# Altium project MSE312_SIMRACER.PrjPcb
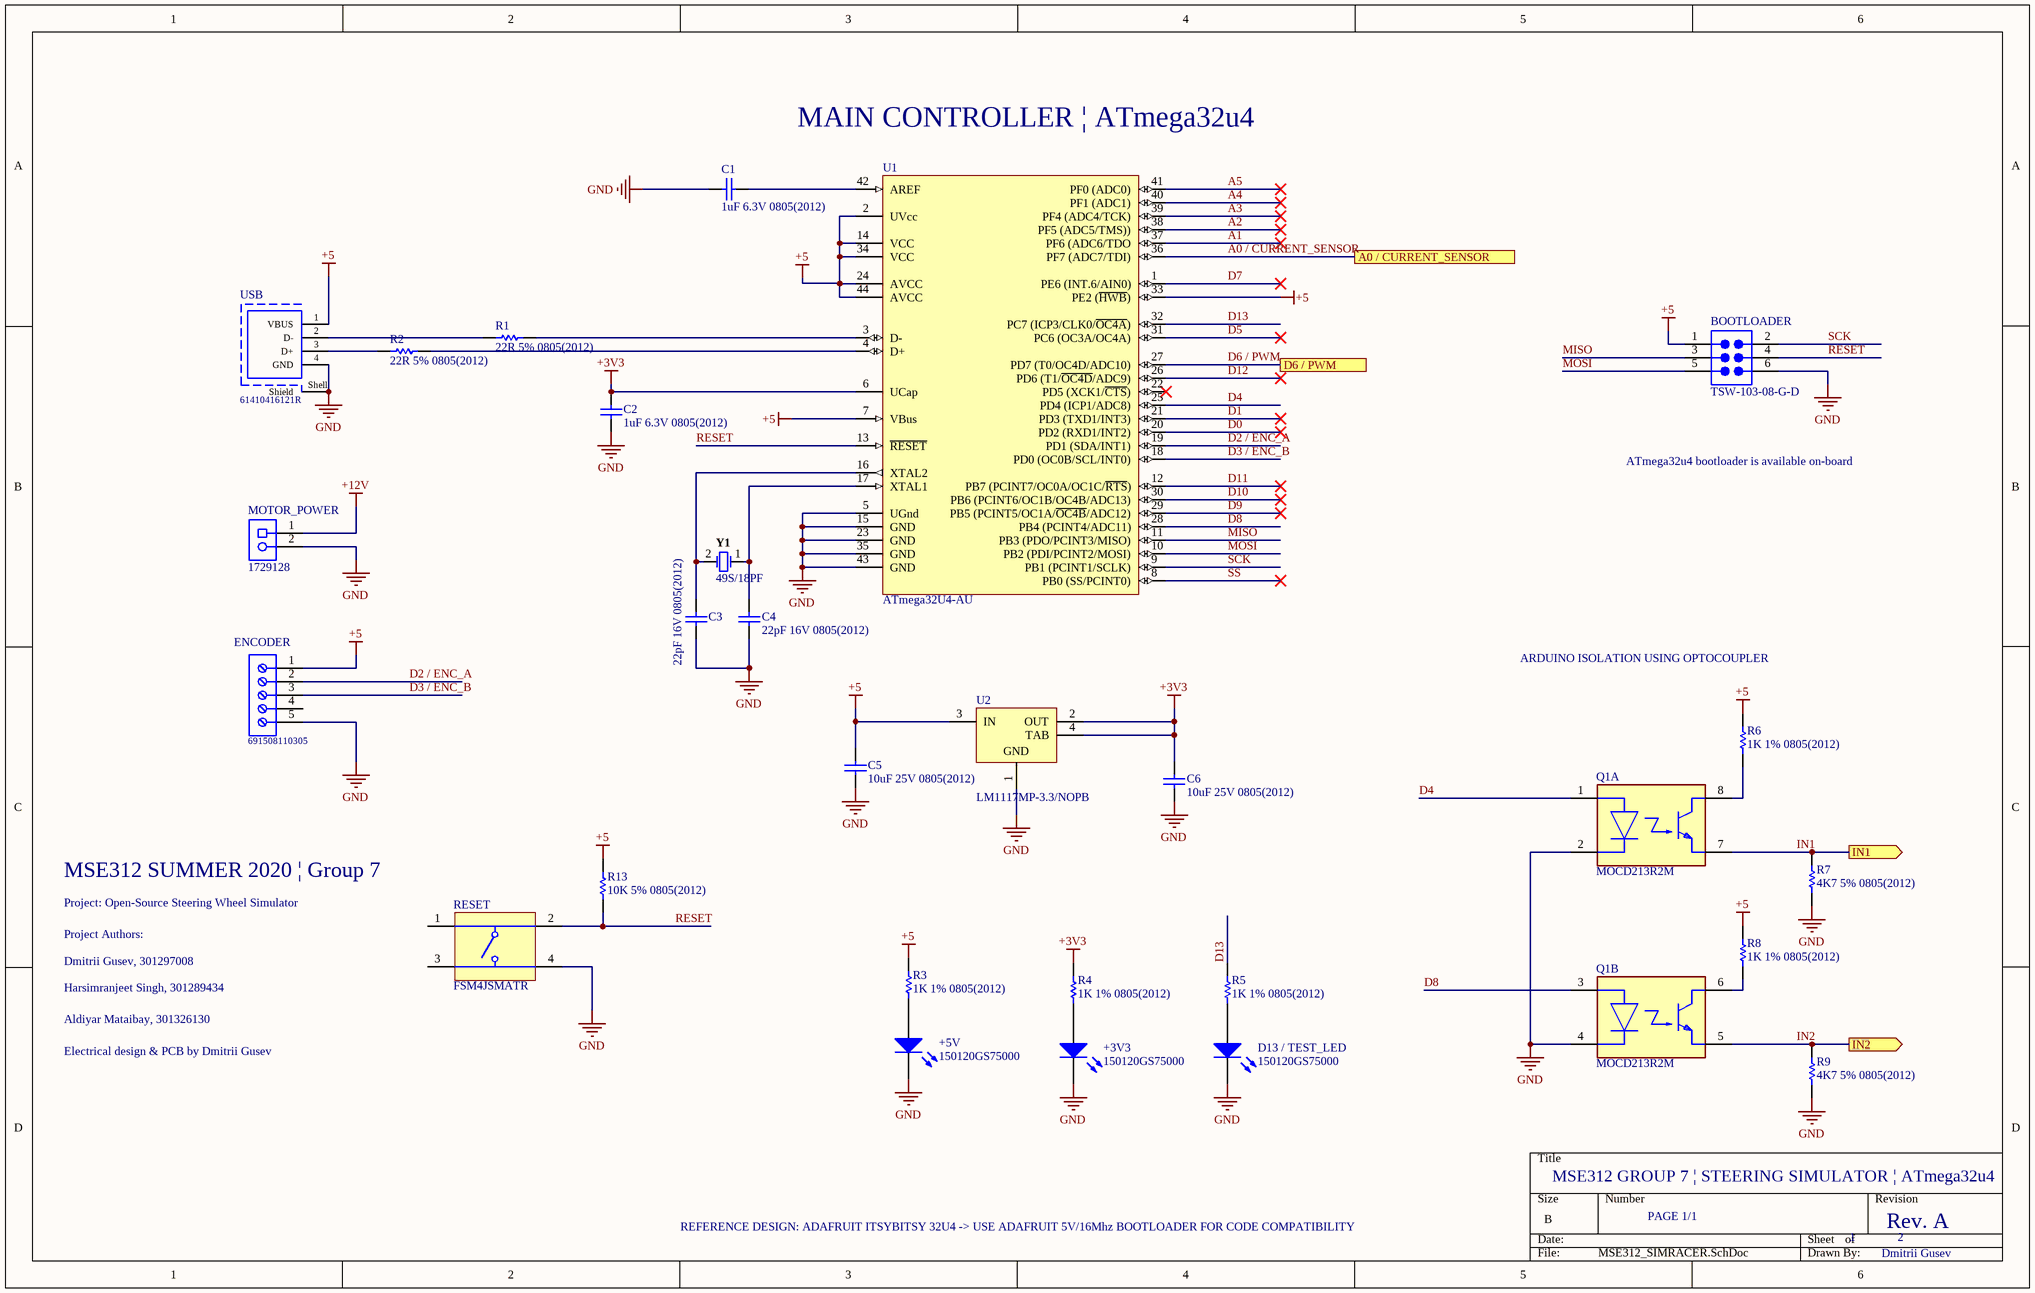
[diagram p0: MSE312_SIMRACER.SchDoc]
2 sheets, 42 parts. Net scope: flat (ports and power ports of the same name join across sheets).
Board file: MSE312_SIMRACER.PcbDoc
Sheets:
  MSE312_SIMRACER.SchDoc
  L298N.SchDoc

## Sheet MSE312_SIMRACER.SchDoc
size B

### Parts
+3V3  150120GS75000  [1206_A]
+5V  150120GS75000  [1206_A]
BOOTLOADER  TSW-103-08-G-D  [SMTC-TSW-103-08-X-D]
C1  1uF 6.3V 0805(2012)  [CAPC0805(2012)145_N]
C2  1uF 6.3V 0805(2012)  [CAPC0805(2012)145_N]
C3  22pF 16V 0805(2012)  [CAPC0805(2012)100_N]
C4  22pF 16V 0805(2012)  [CAPC0805(2012)100_N]
C5  10uF 25V 0805(2012)  [CAPC0805(2012)145_N]
C6  10uF 25V 0805(2012)  [CAPC0805(2012)145_N]
D13_/_TEST_LED  150120GS75000  [1206_A]
ENCODER  691508110305  [691508110305]
MOTOR_POWER  1729128  [PHOE-1729128-2_V]
Q1  MOCD213R2M  [FP-751DZ-MFG]  (parts A,B of 2)
R1  22R 5% 0805(2012)  [RESC0805(2012)_M]
R2  22R 5% 0805(2012)  [RESC0805(2012)_M]
R3  1K 1% 0805(2012)  [RESC0805(2012)_M]
R4  1K 1% 0805(2012)  [RESC0805(2012)_M]
R5  1K 1% 0805(2012)  [RESC0805(2012)_M]
R6  1K 1% 0805(2012)  [RESC0805(2012)_M]
R7  4K7 5% 0805(2012)  [RESC0805(2012)_N]
R8  1K 1% 0805(2012)  [RESC0805(2012)_M]
R9  4K7 5% 0805(2012)  [RESC0805(2012)_N]
R13  10K 5% 0805(2012)  [RESC0805(2012)_L]
RESET  FSM4JSMATR  [TECO-FSM4JSMATR_V]
U1  ATmega32U4-AU  [44ML_M]
U2  LM1117MP-3.3/NOPB  [DCY0004A_L]
USB  61410416121R  [61410416121R]
Y1  49S/18PF  [JPY-49S-18PF]

### Ports
A0 / CURRENT_SENSOR, D6 / PWM, IN1 (out), IN2 (out)

### Nets
+3V3: C2.2 C6.2 R4.2 U1.6(UCap) U2.2(OUT) U2.4(TAB)
+5: BOOTLOADER.1 C5.2 ENCODER.1 R3.2 R6.2 R8.2 R13.2 U1.2(UVcc) U1.7(VBus) U1.14(VCC) U1.24(AVCC) U1.33(PE2_(~{HWB})) U1.34(VCC) U1.44(AVCC) U2.3(IN) USB.1(VBUS)
+12V: MOTOR_POWER.1
GND: +3V3.1(K) +5V.1(K) BOOTLOADER.6 C1.1 C2.1 C3.1 C4.1 C5.1 C6.1 D13_/_TEST_LED.1(K) ENCODER.5 MOTOR_POWER.2 Q1.2(CATHODE1) Q1.4(CATHODE2) R7.1 R9.1 RESET.4 U1.5(UGnd) U1.15(GND) U1.23(GND) U1.35(GND) U1.43(GND) U2.1(GND) USB.4(GND) USB.Shell(Shield)
A0 / CURRENT_SENSOR: U1.36(PF7_(ADC7/TDI)) ; port A0 / CURRENT_SENSOR
A1: U1.37(PF6_(ADC6/TDO)
A2: U1.38(PF5_(ADC5/TMS)))
A3: U1.39(PF4_(ADC4/TCK))
A4: U1.40(PF1_(ADC1))
A5: U1.41(PF0_(ADC0))
D0: U1.20(PD2_(RXD1/INT2))
D1: U1.21(PD3_(TXD1/INT3))
D2 / ENC_A: ENCODER.2 U1.19(PD1_(SDA/INT1))
D3 / ENC_B: ENCODER.3 U1.18(PD0_(OC0B/SCL/INT0))
D4: Q1.1(ANODE1) U1.25(PD4_(ICP1/ADC8))
D5: U1.31(PC6_(OC3A/OC4A))
D6 / PWM: U1.27(PD7_(T0/OC4D/ADC10)) ; port D6 / PWM
D7: U1.1(PE6_(INT.6/AIN0))
D8: Q1.3(ANODE2) U1.28(PB4_(PCINT4/ADC11))
D9: U1.29(PB5_(PCINT5/OC1A/~{OC4B}/ADC12))
D10: U1.30(PB6_(PCINT6/OC1B/OC4B/ADC13))
D11: U1.12(PB7_(PCINT7/OC0A/OC1C/~{RTS}))
D12: U1.26(PD6_(T1/~{OC4D}/ADC9))
D13: R5.2 U1.32(PC7_(ICP3/CLK0/~{OC4A}))
IN1: Q1.7(EMITTER1) R7.2 ; port IN1
IN2: Q1.5(EMITTER2) R9.2 ; port IN2
MISO: BOOTLOADER.3 U1.11(PB3_(PDO/PCINT3/MISO))
MOSI: BOOTLOADER.5 U1.10(PB2_(PDI/PCINT2/MOSI))
RESET: BOOTLOADER.4 R13.1 RESET.2 U1.13(~{RESET})
SCK: BOOTLOADER.2 U1.9(PB1_(PCINT1/SCLK))
SS: U1.8(PB0_(SS/PCINT0))
Net+3V3_2: +3V3.2(A) R4.1
Net+5V_2: +5V.2(A) R3.1
NetC1_2: C1.2 U1.42(AREF)
NetC3_2: C3.2 U1.16(XTAL2) Y1.2
NetC4_2: C4.2 U1.17(XTAL1) Y1.1
NetD13_/_TEST_LED_2: D13_/_TEST_LED.2(A) R5.1
NetQ1_6: Q1.6(COLLECTOR2) R8.1
NetQ1_8: Q1.8(COLLECTOR1) R6.1
NetR1_1: R1.1 USB.2(D-)
NetR1_2: R1.2 U1.3(D-)
NetR2_1: R2.1 USB.3(D+)
NetR2_2: R2.2 U1.4(D+)

Not connected (* = marked no-connect by the designer): ENCODER 4; RESET 1 3; U1 22(PD5_(XCK1/~{CTS}))*

### Notes on the sheet
- MAIN CONTROLLER | ATmega32u4
- ATmega32u4 bootloader is available on-board
- ARDUINO ISOLATION USING OPTOCOUPLER
- MSE312 SUMMER 2020 | Group 7
- Project: Open-Source Steering Wheel Simulator
- Project Authors:
- Dmitrii Gusev, 301297008
- Harsimranjeet Singh, 301289434
- Aldiyar Mataibay, 301326130
- Electrical design & PCB by Dmitrii Gusev
- REFERENCE DESIGN: ADAFRUIT ITSYBITSY 32U4 -> USE ADAFRUIT 5V/16Mhz BOOTLOADER FOR CODE COMPATIBILITY
- MSE312 GROUP 7 | STEERING SIMULATOR | ATmega32u4
- PAGE 1/1
- 1
- Rev. A
- 2
- Dmitrii Gusev

### Library data of the parts
+3V3 +5V D13_/_TEST_LED = CMP-1426-00014-1: SMD mono-color Chip LED, WL-SMCW, Green; Manufacturer: Wuerth Elektronik; PackageReference: 1206_A; PartNumber: 150120GS75000; ComponentLink1Description: Manufacturer URL; ComponentLink2URL: http://katalog.we-online.com/led/datasheet/150120GS75000.pdf; ComponentLink2Description: Datasheet; Color: Green; ComponentLink1URL: http://www.we-online.com
BOOTLOADER = CMP-1024-00338-1: Manufacturer: Samtec; Pitch: 2.54 mm; ComponentLink1URL: http://www.samtec.com; ComponentLink2URL: http://www.samtec.com/documents/webfiles/pdf/TSW_TH.PDF; Temperature Range: -55 to 125 degC; RoHS: True; ComponentLink2Description: Datasheet; PackageReference: TSW-103-08-X-D; ComponentLink3Description: Package Specification; PackageDescription: .025[0.64] SQ. Post Terminal Strip Assembly; DatasheetVersion: F-214; Mounting Technology: Through-hole; ComponentLink1Description: Manufacturer URL; Orientation: Vertical; PartNumber: TSW-103-08-G-D; PackageVersion: DM, 8/1988; ComponentLink3URL: http://www.samtec.com/documents/webfiles/cpdf/TSW-XXX-XX-XXX-X-XX-XXX-MKT.pdf
C1 C2 = CMP-1036-04731-1: CAP 1uF 6.3V ±10% 0805 (2012 Metric) Thickness 1.45mm SMD; Case-Metric: 2012; Case-EIA: 0805; Tolerance: Â±10%; Max Thickness: 1.45 mm; Technology: SMT; Value: 1uF; Rated Voltage: 6.3 V
C3 C4 = CMP-1036-01215-1: CAP 22pF 16V ±0.5pF 0805 (2012 Metric) Thickness 1mm SMD; Tolerance: Â±0.5pF; Case-EIA: 0805; Case-Metric: 2012; Max Thickness: 1 mm; Technology: SMT; Rated Voltage: 16 V; Value: 22pF
C5 C6 = CMP-1036-04932-1: CAP 10uF 25V ±10% 0805 (2012 Metric) Thickness 1.45mm SMD; Case-EIA: 0805; Case-Metric: 2012; Tolerance: Â±10%; Technology: SMT; Value: 10uF; Rated Voltage: 25 V; Max Thickness: 1.45 mm
ENCODER = CMP-1502-02493-1: Serie 5081 - 3.50 mm Horizontal Entry SMT with Rising Cage Clamp WR-TBL, 5 pin; Manufacturer: Wurth Elektronik; Pin Number: 5; Pitch: 3.50mm; Operating Temperature: -40to130degC; Packaging: TapeandReelwithCap; Part Number: 691508110305; Publisher: WurthElektronik; Datasheet URL: http://katalog.we-online.de/em/datasheet/6915081103xx.pdf; Mounting Technology: SMT; Package Reference: 691508110305; Manufacturer URL: http://www.we-online.de
MOTOR_POWER = CMP-2000-05815-1: PCB Terminal Block, 13.5 A, 400 V, 2-Pin THD, RoHS, Bulk; Manufacturer: Phoenix Contact; Package Version: 03/2015; No. of Rows: 1; Pitch: 5.08mm; No. of Positions: 2; Voltage Rating: 400V; Current Rating: 13500mA; Manufacturer URL: http://www.phoenixcontact.com/; Datasheet URL: https://datasheet.ciiva.com/16046/1729128-16046181.pdf; RoHS: TRUE; Package URL: https://www.phoenixcontact.com/online/portal/pi/pxc/product_detail_page/!ut/p/b1/3VdJjqNKFDxLH8AFycySyWY2ozFsEPOMMQaDOX1XedGL_1Vdm5YXJleknhSKeBkvI6EA8ncAo3AYoDhBQGco6KN7VURTdemj9us_IEKEZo_YHiPAEWEFmDGOHMORkqKYCORBZxgL7ZoaZYcbFFUZ3fqxSY6GOuxydWUuHqz1ynmMFygu583Bob0Ewr6Sd_l-5m-kAueHiB0jpRwZwe58wwtkpxtMYd_LmGcDRU02dRNEyWt6Y2ti5pSyJ_reIkzIulrqApdnbT11V5jnCKbYNCvhEM1MCpPByat_X379-iThf08CI5GfOPqfBeS3BRoBOdD55AKVv0iLwCMq-2BrzXWSGRH7pUGD9uwXQjiph3xL0DKQwdGa0JImiIOmBNOestqgwTHSSs2oOep-78apyXQBvNi8ZLaFjvjWvcaUEBu0MC6Wbe-d6mB0FAebo2lUWinqYaZs5DAYzV0RP9yitUjnGJ0iI9xhZkT42OCQNUJJhkgWINNQLP2JFP6OpMg3JCVg70jqHT0lvKOnhHf0lPuOnnLf0VPuWx6_dxwUIvwk5WMkT0kLL1mh61l2yZVSzG3pYV_bqo-mj6uMKwKwdnnW8Jh5RTOJzMOA5c-eJDaZQw4mTMPH02PvS_ZAqNVjVTo2WyYLkwH_KU1mmmG5kjRhDqPXLwwVHvVOjCM60-fpXvTDfMGW1PVFVS1r4e4yVDk4ZdNbkUHvqPqQSeian4UD39fNKmachqdJ1NJbyk8rXT9mXTvPk3oE5meulKGgiruPJek-4I9hTT6G8ZLOyRSm2RRVbThERQad5OS28hdt4YW4vG0stgYYzsWsK4_7y6DZMjJSCqri1kyiZR5vD7pwIrNR7QwPHTcLTI5qT7eRlpHrdGiupYlqQDJ7zy_CND8fWWBoLRXxk1RVcXiBQwbTD4Xi7KL-FuO94t9xaqweXzH; PartNumber: 1729128; Package Description: 2-Pin Through Hole Device, Body 8.1 x 10.16 mm, Pitch 5.08 mm; Datasheet Version: 12/2013; Mounting Technology: ThroughHole; Orientation: Horizontal; Package Reference: 1729128-2; Packing: Bulk
Q1 = CMP-07144-000004-1: OPTOISO 2.5KV 2CH TRANS 8SOIC; Manufacturer: ON Semiconductor; Forward Current: 10mA; Reverse Voltage: 6V; Emiiter Collector Voltage: 7V; Isolation Voltage: 2500Vrms; Max Junction Temp: +125°C; Turn On Delay Time: 7.5us; Standoff Height: 0.08mm; Forward Voltage: 1.15V; Min Current Transfer Ratio: 100%; Collector Emitter Voltage: 70V; Power Dissipation: 240mW; Turn Off Delay Time: 5.7us; Footprint Url: https://www.onsemi.com/pub/Collateral/751DZ.PDF; Lead Free: Yes; Ambient Temperature Range High: +100°C; ComponentLink2URL: https://www.onsemi.com/pub/Collateral/MOCD217M-D.PDF; Digikey Description: OPTOISO 2.5KV 2CH TRANS 8SOIC; Ambient Temperature Range Low: -40°C; Device Class L3: unset; Device Class L2: Optocouplers; Height: 3.63mm; Device Class L1: Optoelectronics; Package: 751DZ; Temperature Range Low: -40°C; Temperature: -40°C to +100°C; Manufacturer Part Number: MOCD213R2M; Temperature Range High: +100°C; Category: Trans; Automotive: No; ComponentLink2Description: Datasheet; Mouser Description: Optocoupler DC-IN 2-Channel Transistor DC-Output 8-Pin SOIC N T/R; Octopart: https://octopart.com/mocd213r2m-on+semiconductor-84330505; RoHS: TRUE; PartId: 1
R1 R2 = CMP-1013-00034-1: 22R 0.125W 5% 0805 (2012 Metric)  SMD; Case-Metric: 2012; Value: 22.00 Ohm; Case-EIA: 0805; Power: 0.125 W; Technology: SMT; Tolerance: 5 %
R3-R6 R8 = CMP-1013-00510-1: 1K 0.125W 1% 0805 (2012 Metric)  SMD; Case-Metric: 2012; Value: 1000.00 Ohm; Case-EIA: 0805; Tolerance: 1 %; Power: 0.125 W; Technology: SMT
R7 R9 = CMP-1013-00090-1: 4K7 0.125W 5% 0805 (2012 Metric)  SMD; Case-EIA: 0805; Value: 4700.00 Ohm; Case-Metric: 2012; Power: 0.125 W; Tolerance: 5 %; Technology: SMT
R13 = CMP-1013-00098-1: 10K 0.125W 5% 0805 (2012 Metric)  SMD; Case-EIA: 0805; Case-Metric: 2012; Value: 10000.00 Ohm; Power: 0.125 W; Technology: SMT; Tolerance: 5 %
RESET = CMP-2000-07486-1: Micro Miniature Push Button Switch FSM JSM, 50 mA, -35 to 85 degC, 4-Pin SMD, RoHS, Tape and Reel; Manufacturer: TE Connectivity; Mechanical Life: 100000Cycles; Current Rating: 50mA; Actuator Material: Polyamide; Max Voltage Rating (DC): 12V; Capacitance: 0f; Illumination Type: Illuminated; Voltage Rating (DC): 24V; Case\/Package: SMD/SMT; Operating Force: 160gf; Contact Resistance: 100mOhm; Actuator Length: 0.055inch; Switch Travel: 0.25mm; Throw Configuration: SPST; Termination: GullWing; Contact Plating: Silver; Orientation: Straight; Mounting Technology: SurfaceMount; REACH SVHC: Unknown; Electrical Life: 100000Cycles; Package Reference: FSM4JSMATR; Max Operating Temperature: 85degC; Manufacturer URL: http://www.te.com/; Package Description: 4-Pin Surface Mount Device, Body 6 x 6 mm, Pitch 4.5 mm; Datasheet Version: Rev. V, 02/2015; Packaging: TapeandReel; Min Operating Temperature: -35degC; Mount: SurfaceMount; Contact Current Rating: 50mA; Contact Material: CopperAlloy; Package Quantity: 1200; Datasheet URL: http://www.te.com/commerce/DocumentDelivery/DDEController?Action=showdoc&DocId=Customer+Drawing%7F2-1437565-7%7FV%7Fpdf%7FEnglish%7FENG_CD_2-1437565-7_V.pdf%7F4-1437565-2; RoHSCompliant: true
U1 = CMP-0095-00285-2: 8-bit AVR Microcontroller, 2.7-5.5V, 16MHz, 32KB Flash, 1KB EEPROM, 2.5KB SRAM, USB Controller, 44-pin TQFP, Industrial Grade (-40°C to 85°C), Ext Osc; RevisionNote: DatasheetVersion updated. URLs added.; ComponentLink1Description: Manufacturer URL; PackageDescription: 44-Pin Plastic Thin Quad Flat Pack, 10 x 10 x 1.0 mm Body, 0.8 mm Pitch (TQFP); DatasheetVersion: revF, Nov-2010; ComponentLink2URL: http://www.atmel.com/dyn/resources/prod_documents/doc7766.pdf; ComponentLink1URL: http://www.atmel.com/; PackageReference: 44ML; ComponentLink2Description: ATmega16U4/32U4 Datasheet; PackageVersion: rev.G, Jul-2007; ComponentLink3URL: http://www.atmel.com/dyn/resources/prod_documents/7766S.pdf; ComponentLink3Description: ATmega16U4 ATmega32U4 Summary
U2 = CMP-0062-01638-4: 800mA Low-Dropout Linear Regulator, 4-pin SOT-223, Pb-Free; Manufacturer: Texas Instruments; CompType: LDO IC; PackageTopMarking: XYTT*N05A; High-Reliability: Y; PowerWise: N; ComponentLink1URL: http://www.ti.com/general/docs/lit/getliterature.tsp?genericPartNumber=LM1117-N&fileType=pdf; PinCount: 4; PackageDescription: Molded SOT-223, 6.50 x 3.56 x 1.6mm Body, 4 Lead, 2.3mm Pitch; Code_IPC: SOT223-4; PartNumber: LM1117MP-3.3/NOPB; Code_JEDEC: TO-261-AA; RoHS: Y; PackageReference: DCY0004A; ComponentLink1Description: Datasheet URL
USB = CMP-1502-03245-1: USB 2.0 Type B Receptacle WR-COM, Horizontal, SMT; Manufacturer: Wurth Elektronik; Rated Current: 1.5A; Working Voltage: 30VAC; Contact Resistance: 30mOhm; Datasheet URL: https://katalog.we-online.de/em/datasheet/61410416121R.pdf; Part Number: 61410416121R; Operating Temperature: -55to85degC; Gender: Receptacle; Orientation: Horizontal; Manufacturer URL: http://www.we-online.de; Mounting Technology: SMT; Publisher: WurthElektronik; Connector Type: USB2.0TypeB; Package Reference: 61410416121R; Packaging: TapeandReel
Y1 = CMP-2100-03581-1: Crystal, 16 MHz, 18 pF, -20 to 70 degC, 2-Pin THD; Manufacturer: Shenzhen Jingpengyuan; Package Description: 2-Pin Through Hole Device, Body 11.05 x 4.65 mm, Pitch 4.88 mm; Package Reference: 49S-18PF; Datasheet Version: 41852.0; Datasheet URL: http://datasheet.octopart.com/49S-18PF-Xinhunjing-datasheet-30677139.pdf; Manufacturer URL: http://www.chjiahui.com/

## Sheet L298N.SchDoc
size B
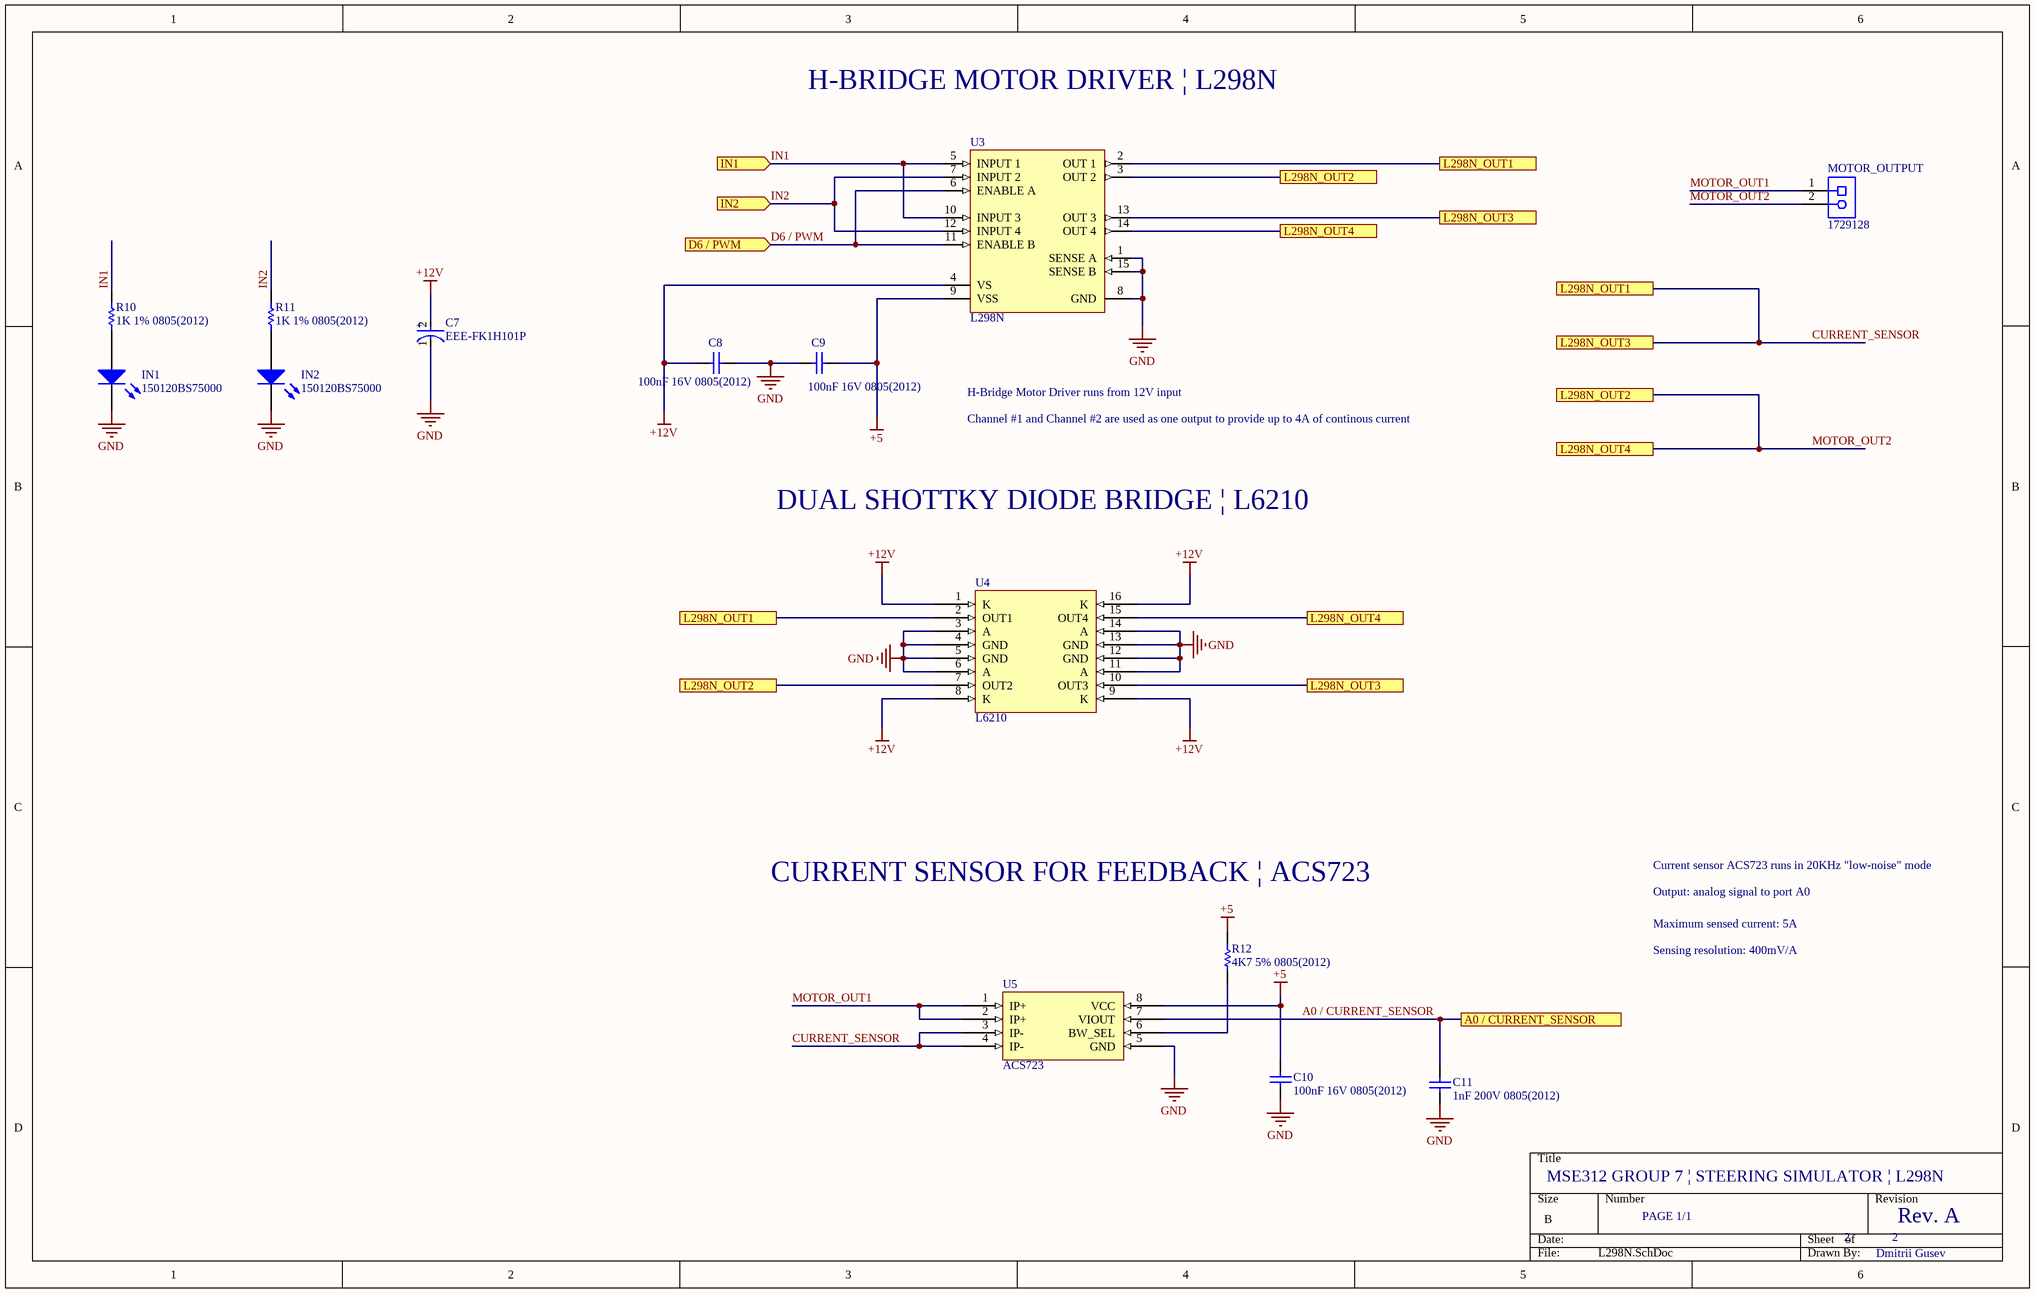
[diagram p1: L298N.SchDoc]

### Parts
C7  EEE-FK1H101P  [FP-EEE-FK1H101P-MFG]
C8  100nF 16V 0805(2012)  [CAPC0805(2012)100_L]
C9  100nF 16V 0805(2012)  [CAPC0805(2012)100_L]
C10  100nF 16V 0805(2012)  [CAPC0805(2012)100_L]
C11  1nF 200V 0805(2012)  [CAPC0805(2012)145_L]
IN1  150120BS75000  [1206_A]
IN2  150120BS75000  [1206_A]
MOTOR_OUTPUT  1729128  [PHOE-1729128-2_V]
R10  1K 1% 0805(2012)  [RESC0805(2012)_M]
R11  1K 1% 0805(2012)  [RESC0805(2012)_M]
R12  4K7 5% 0805(2012)  [RESC0805(2012)_N]
U3  L298N  [STM-FM-15]
U4  L6210  [L6210]
U5  ACS723  [ACS723]

### Ports
A0 / CURRENT_SENSOR, D6 / PWM (in), IN1 (in), IN2 (in), L298N_OUT1, L298N_OUT2, L298N_OUT3, L298N_OUT4

### Nets
+5: C9.2 C10.2 R12.2 U3.9(VSS) U5.8(VCC)
+12V: C7.2(A) C8.1 U3.4(VS) U4.1(K) U4.8(K) U4.9(K) U4.16(K)
GND: C7.1(C) C8.2 C9.1 C10.1 C11.1 IN1.1(K) IN2.1(K) U3.1(SENSE_A) U3.8(GND) U3.15(SENSE_B) U4.3(A) U4.4(GND) U4.5(GND) U4.6(A) U4.11(A) U4.12(GND) U4.13(GND) U4.14(A) U5.5(GND)
A0 / CURRENT_SENSOR: C11.2 U5.7(VIOUT) ; port A0 / CURRENT_SENSOR
CURRENT_SENSOR: U3.2(OUT_1) U3.13(OUT_3) U4.2(OUT1) U4.10(OUT3) U5.3(IP-) U5.4(IP-) ; port L298N_OUT1, port L298N_OUT3
D6 / PWM: U3.6(ENABLE_A) U3.11(ENABLE_B) ; port D6 / PWM
IN1: R10.2 U3.5(INPUT_1) U3.10(INPUT_3) ; port IN1
IN2: R11.2 U3.7(INPUT_2) U3.12(INPUT_4) ; port IN2
MOTOR_OUT1: MOTOR_OUTPUT.1 U5.1(IP+) U5.2(IP+)
MOTOR_OUT2: MOTOR_OUTPUT.2 U3.3(OUT_2) U3.14(OUT_4) U4.7(OUT2) U4.15(OUT4) ; port L298N_OUT2, port L298N_OUT4
NetIN1_2: IN1.2(A) R10.1
NetIN2_2: IN2.2(A) R11.1
NetR12_1: R12.1 U5.6(BW_SEL)

### Notes on the sheet
- H-BRIDGE MOTOR DRIVER | L298N
- H-Bridge Motor Driver runs from 12V input
- Channel #1 and Channel #2 are used as one output to provide up to 4A of continous current
- DUAL SHOTTKY DIODE BRIDGE | L6210
- CURRENT SENSOR FOR FEEDBACK | ACS723
- Current sensor ACS723 runs in 20KHz "low-noise" mode
- Output: analog signal to port A0
- Maximum sensed current: 5A
- Sensing resolution: 400mV/A
- MSE312 GROUP 7 | STEERING SIMULATOR | L298N
- PAGE 1/1
- 2
- Rev. A
- Dmitrii Gusev
- (in symbol CMP-05427-000005-1) +

### Library data of the parts
C7 = CMP-05427-000005-1: CAP ALUM 100UF 20% 50V SMD; Manufacturer: Panasonic Electronic Components; Automotive Grade: Grade 2; Dissipation Factor: 10%; Life: 2000Hours; Ripple Current: 350mA; Material: Aluminum; Esr: 0.34Ω; Leakage Current: 50uA; Tolerance: 20%; Package: 0; ComponentLink2URL: https://industrial.panasonic.com/cdbs/www-data/pdf/RDE0000/ABA0000C1181.pdf; Manufacturer Part Number: EEE-FK1H101P; Temperature Range Low: -55°C; Voltage Rating: 50V; ComponentLink2Description: Datasheet; Category: Cap; Digikey Description: CAP ALUM 100UF 20% 50V SMD; Octopart: https://octopart.com/eeefk1h101p-panasonic-4642841; Automotive: Yes; Temperature: -55°C to +105°C; Capacitance: 100uF; Lead Free: Yes; Mouser Description: Cap Aluminum Lytic 100uF 50V 20% (8 X 10.2mm) SMD 350mA 2000h 105C Automotive T/R; Height: 10.5mm; Device Class L3: Aluminum Electrolytic Capacitors; Value: 100uF; Device Class L1: Passive Components; RoHS: TRUE; Device Class L2: Capacitors; Temperature Range High: +105°C
C8-C10 = CMP-1036-04400-1: CAP 100nF 16V ±5% 0805 (2012 Metric) Thickness 1mm SMD; Case-EIA: 0805; Tolerance: Â±5%; Case-Metric: 2012; Max Thickness: 1 mm; Value: 100nF; Technology: SMT; Rated Voltage: 16 V
C11 = CMP-1036-02999-1: CAP 1nF 200V ±10% 0805 (2012 Metric) Thickness 1.45mm SMD; Tolerance: Â±10%; Case-Metric: 2012; Case-EIA: 0805; Technology: SMT; Max Thickness: 1.45 mm; Value: 1nF; Rated Voltage: 200 V
IN1 IN2 = CMP-1426-00015-1: SMD mono-color Chip LED, WL-SMCW, Blue; Manufacturer: Wuerth Elektronik; ComponentLink2Description: Datasheet; ComponentLink1URL: http://www.we-online.com; PartNumber: 150120BS75000; ComponentLink1Description: Manufacturer URL; ComponentLink2URL: http://katalog.we-online.com/led/datasheet/150120BS75000.pdf; PackageReference: 1206_A; Color: Blue
MOTOR_OUTPUT = CMP-2000-05815-1: as MOTOR_POWER on sheet MSE312_SIMRACER; Manufacturer URL: http://www.phoenixcontact.com/; Datasheet URL: https://datasheet.ciiva.com/16046/1729128-16046181.pdf; RoHS: TRUE; Package URL: https://www.phoenixcontact.com/online/portal/pi/pxc/product_detail_page/!ut/p/b1/3VdJjqNKFDxLH8AFycySyWY2ozFsEPOMMQaDOX1XedGL_1Vdm5YXJleknhSKeBkvI6EA8ncAo3AYoDhBQGco6KN7VURTdemj9us_IEKEZo_YHiPAEWEFmDGOHMORkqKYCORBZxgL7ZoaZYcbFFUZ3fqxSY6GOuxydWUuHqz1ynmMFygu583Bob0Ewr6Sd_l-5m-kAueHiB0jpRwZwe58wwtkpxtMYd_LmGcDRU02dRNEyWt6Y2ti5pSyJ_reIkzIulrqApdnbT11V5jnCKbYNCvhEM1MCpPByat_X379-iThf08CI5GfOPqfBeS3BRoBOdD55AKVv0iLwCMq-2BrzXWSGRH7pUGD9uwXQjiph3xL0DKQwdGa0JImiIOmBNOestqgwTHSSs2oOep-78apyXQBvNi8ZLaFjvjWvcaUEBu0MC6Wbe-d6mB0FAebo2lUWinqYaZs5DAYzV0RP9yitUjnGJ0iI9xhZkT42OCQNUJJhkgWINNQLP2JFP6OpMg3JCVg70jqHT0lvKOnhHf0lPuOnnLf0VPuWx6_dxwUIvwk5WMkT0kLL1mh61l2yZVSzG3pYV_bqo-mj6uMKwKwdnnW8Jh5RTOJzMOA5c-eJDaZQw4mTMPH02PvS_ZAqNVjVTo2WyYLkwH_KU1mmmG5kjRhDqPXLwwVHvVOjCM60-fpXvTDfMGW1PVFVS1r4e4yVDk4ZdNbkUHvqPqQSeian4UD39fNKmachqdJ1NJbyk8rXT9mXTvPk3oE5meulKGgiruPJek-4I9hTT6G8ZLOyRSm2RRVbThERQad5OS28hdt4YW4vG0stgYYzsWsK4_7y6DZMjJSCqri1kyiZR5vD7pwIrNR7QwPHTcLTI5qT7eRlpHrdGiupYlqQDJ7zy_CND8fWWBoLRXxk1RVcXiBQwbTD4Xi7KL-FuO94t9xaqweXzH; PartNumber: 1729128; Package Description: 2-Pin Through Hole Device, Body 8.1 x 10.16 mm, Pitch 5.08 mm; Datasheet Version: 12/2013; Mounting Technology: ThroughHole; Orientation: Horizontal; Package Reference: 1729128-2; Packing: Bulk
R10 R11 = CMP-1013-00510-1: as R3 on sheet MSE312_SIMRACER; Tolerance: 1 %; Power: 0.125 W; Technology: SMT
R12 = CMP-1013-00090-1: as R7 on sheet MSE312_SIMRACER; Power: 0.125 W; Tolerance: 5 %; Technology: SMT
U3 = CMP-2000-06526-1: Dual Full-Bridge Driver, 4.8 to 46 V, -40 to 150 degC, 15-Pin FM (MW 15L), RoHS, Tube; Manufacturer: STMicroelectronics; PartNumber: L298; Output Current: 2A; Supply Voltage Max: 7V; Driver Case Style: Multiwatt; Supply Voltage Min: 4.5V; No. of Pins: 15Pins; SVHC: NoSVHC(17-Dec-2015); Output Voltage: 46V; No. of Outputs: 4Outputs; Motor Type: FullBridge; MSL: -; Package Description: 15-Pin Flange Mount, Body 5 x 19.6 mm, Pitch 1.27 mm; Datasheet Version: 01/2000; Package Reference: FM-15; Mounting Technology: ThroughHole; Packaging: Each; Automotive Qualification Standard: -; Product Range: -; Datasheet URL: https://datasheet.ciiva.com/15109/getdatasheetpartid-50682-15109332.pdf; Operating Temperature Max: 130°C; Operating Temperature Min: -25°C; Manufacturer URL: http://www.st.com/

## Nets that join several sheets
+5: MSE312_SIMRACER (16 pins), L298N (5 pins)
+12V: MSE312_SIMRACER (MOTOR_POWER.1), L298N (7 pins)
GND: MSE312_SIMRACER (25 pins), L298N (19 pins)
A0 / CURRENT_SENSOR: MSE312_SIMRACER (U1.36), L298N (C11.2 U5.7)
D6 / PWM: MSE312_SIMRACER (U1.27), L298N (U3.6 U3.11)
IN1: MSE312_SIMRACER (Q1.7 R7.2), L298N (R10.2 U3.5 U3.10)
IN2: MSE312_SIMRACER (Q1.5 R9.2), L298N (R11.2 U3.7 U3.12)